# EAGLE board room_sensors (EAGLE 6.4)
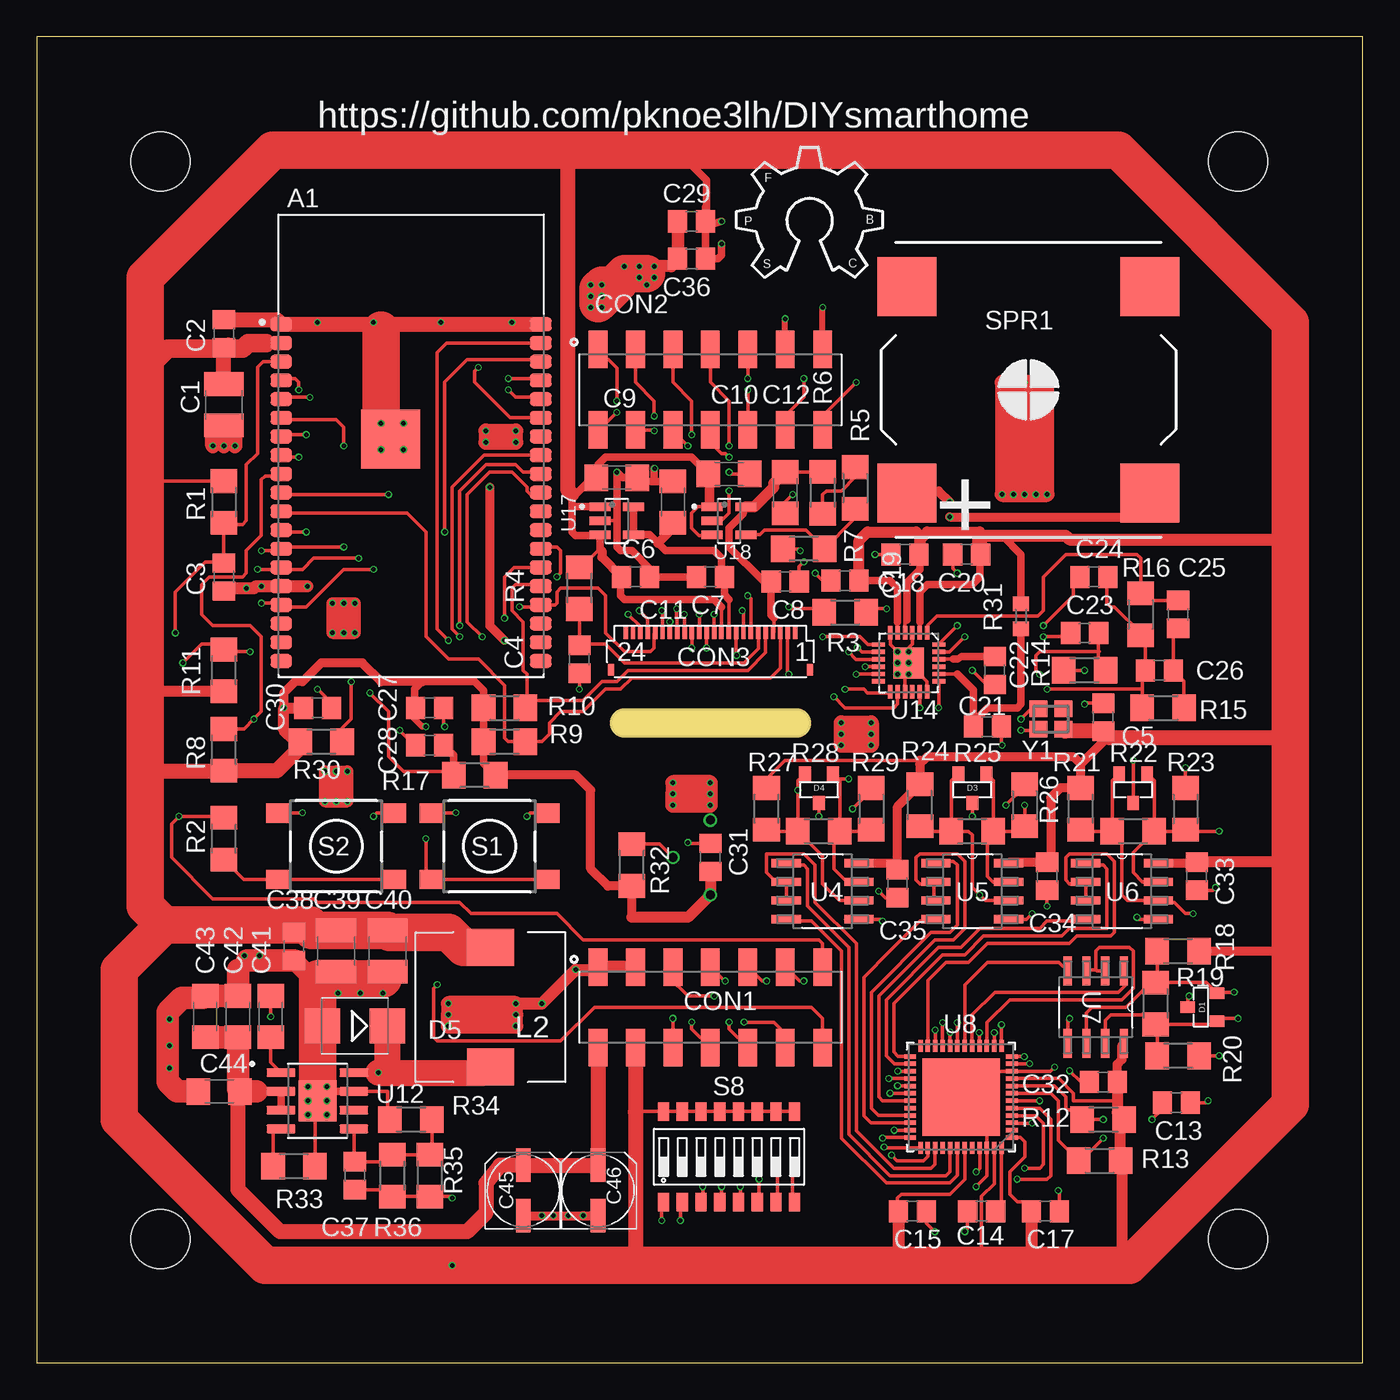
[diagram p6: board, top side]
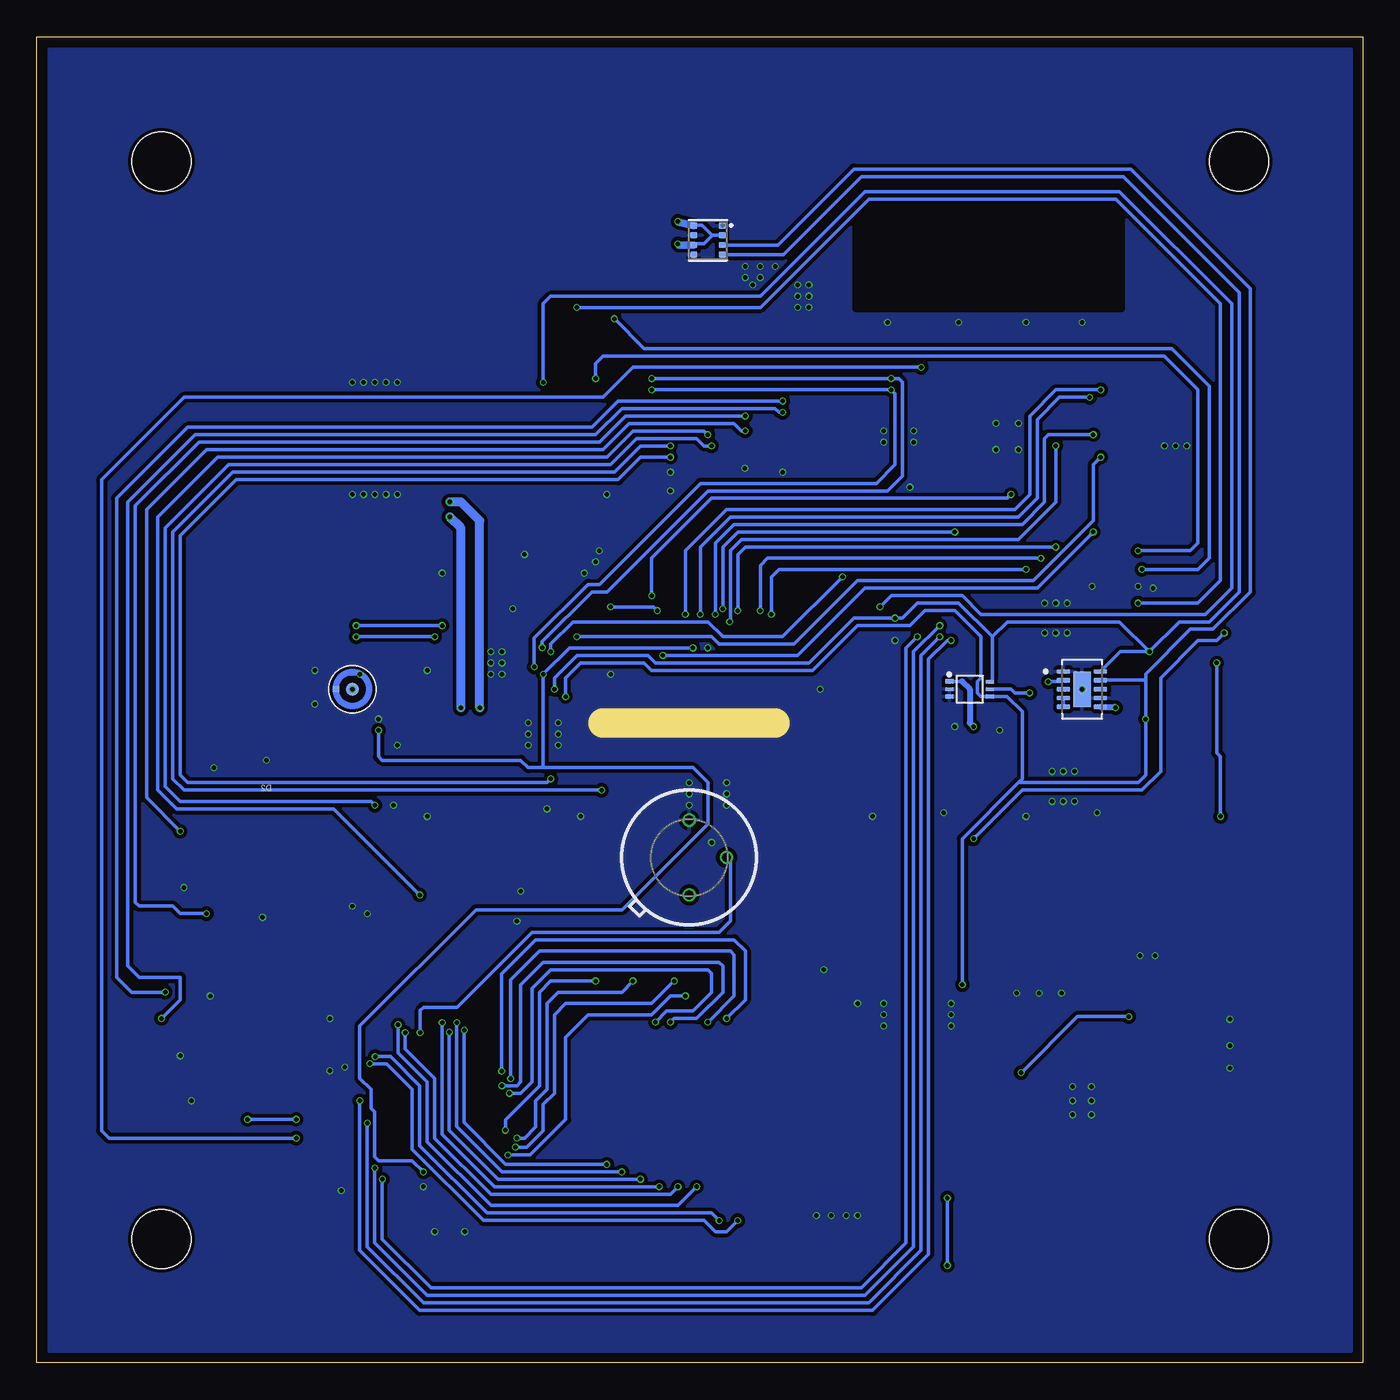
[diagram p7: board, bottom side, seen from below]

Size 90 x 90 mm. Coordinates in mm from the lower left corner, seen from the top.
Outline: 0,0 90,0 90,90 0,90 0,0
Copper layers (1*16): Top 0.035559375mm / dielectric 1.6mm / Bottom 0.035559375mm
Design rules "jlcpcb2layer": minimum track width 5mil, minimum drill 12mil, track to track 5mil, track to pad 5mil, pad to pad 5mil, via to via 5mil, smd to smd 5mil, copper to edge 8mil, drill to drill 6mil, minimum pad ring 5mil, minimum via ring 3mil, stop-mask expansion 2.5mil, vias tented up to drill 0mil, thermal gap 10mil
Holes 4 mm at 81.53,81.53 81.53,8.38 8.38,8.38 8.38,81.53
Milling: 1 lines

## Footprints (pad centres in the part's own frame; a part is rotated, then mirrored left to right if it is on the bottom)
XCVR_ESP32-WROVER-I = smd 1.45 x 0.93: 1 -8.81,8.26; 2 -8.81,6.99; 3 -8.81,5.72; 4 -8.81,4.45; 5 -8.81,3.18; 6 -8.81,1.91; 7 -8.81,0.64; 8 -8.81,-0.63; 9 -8.81,-1.9; 10 -8.81,-3.17; 11 -8.81,-4.44; 12 -8.81,-5.71; 13 -8.81,-6.98; 14 -8.81,-8.25; 15 -8.81,-9.52; 16 -8.81,-10.79; 17 -8.81,-12.06; 18 -8.81,-13.33; 19 -8.81,-14.6; 20 8.81,-14.6; 21 8.81,-13.33; 22 8.81,-12.06; 23 8.81,-10.79; 24 8.81,-9.52; 25 8.81,-8.25; 26 8.81,-6.98; 27 8.81,-5.71; 28 8.81,-4.44; 29 8.81,-3.17; 30 8.81,-1.9; 31 8.81,-0.63; 32 8.81,0.64; 33 8.81,1.91; 34 8.81,3.18; 35 8.81,4.45; 36 8.81,5.72; 37 8.81,6.99; 38 8.81,8.26 | smd 4 x 4: 39 -1.38,0.47
C1210 = smd 1.6 x 2.7: 1 -1.4,0; 2 1.4,0
C0805 = smd 1.3 x 1.5: 1 -0.95,0; 2 0.95,0
C1206 = smd 1.6 x 1.8: 1 -1.4,0; 2 1.4,0
UD-5X5,8_NICHICON = smd 2.3 x 1: + 1.725,0; - -1.7,0
95278-101A14LF = smd 1.27 x 2.54: 1 -7.62,2.73; 2 -7.62,-2.73; 3 -5.08,2.73; 4 -5.08,-2.73; 5 -2.54,2.73; 6 -2.54,-2.73; 7 0,2.73; 8 0,-2.73; 9 2.54,2.73; 10 2.54,-2.73; 11 5.08,2.73; 12 5.08,-2.73; 13 7.62,2.73; 14 7.62,-2.73
FH34SRJ-24S-0.5SH(50) = smd 0.4 x 0.8: NC1 -6.75,-2.5; NC2 6.75,-2.5 | smd 0.3 x 0.8: P$1 5.75,0; P$2 5.25,0; P$3 4.75,0; P$4 4.25,0; P$5 3.75,0; P$6 3.25,0; P$7 2.75,0; P$8 2.25,0; P$9 1.75,0; P$10 1.25,0; P$11 0.75,0; P$12 0.25,0; P$13 -0.25,0; P$14 -0.75,0; P$15 -1.25,0; P$16 -1.75,0; P$17 -2.25,0; P$18 -2.75,0; P$19 -3.25,0; P$20 -3.75,0; P$21 -4.25,0; P$22 -4.75,0; P$23 -5.25,0; P$24 -5.75,0
SOT-23-3 = smd 0.802 x 0.972: 1 -0.95,-1; 2 0.95,-1; 3 0,1
SMB = smd 2.4 x 2.4: A 2.2,0; C -2.2,0
SLF10145T-150M2R2-PF = smd 3.2 x 2.5: P$1 0,4.05; P$2 0,-4.05
R1206 = smd 1.6 x 1.803: 1 -1.422,0; 2 1.422,0
R0603 = smd 1 x 1.1: 1 -0.85,0; 2 0.85,0
DTSM-6 = smd 1.55 x 1.3: 1 -3.975,2.25; 2 3.975,2.25; 3 -3.975,-2.25; 4 3.975,-2.25
DHN-08F-T-V-T/R] = smd 0.76 x 1.25: 1A -4.445,3.075; 1B -4.445,-3.075; 2A -3.175,3.075; 2B -3.175,-3.075; 3A -1.905,3.075; 3B -1.905,-3.075; 4A -0.635,3.075; 4B -0.635,-3.075; 5A 0.635,3.075; 5B 0.635,-3.075; 6A 1.905,3.075; 6B 1.905,-3.075; 7A 3.175,3.075; 7B 3.175,-3.075; 8A 4.445,3.075; 8B 4.445,-3.075
SMS-2008MS-R = smd 4 x 4: + -8.25,-7; - 8.25,-7; M1 -8.25,7; M2 8.25,7
SOTFL50P300X75-6N = smd 0.55 x 0.3: 1 -1.375,0.525 | smd 0.55 x 0.25: 2 -1.375,0; 3 -1.375,-0.5; 4 1.375,-0.5; 5 1.375,0; 6 1.375,0.5
PSON65P250X250X100-8N = smd 0.49 x 0.45: 1 0.97,0.975; 2 0.97,0.325; 3 0.97,-0.325; 4 0.97,-0.975; 5 -0.97,-0.975; 6 -0.97,-0.325; 7 -0.97,0.325; 8 -0.97,0.975
SON60P400X270X110-11N = smd 0.91 x 0.32: 1 -1.255,1.2; 2 -1.255,0.6; 3 -1.255,0; 4 -1.255,-0.6; 5 -1.255,-1.2; 6 1.255,-1.2; 7 1.255,-0.6; 8 1.255,0; 9 1.255,0.6; 10 1.255,1.2 | smd 1.2 x 2.4: 11 0,0
SOIC127P600X175-8N = smd 1.981 x 0.559: 1 -2.464,1.905; 2 -2.464,0.635; 3 -2.464,-0.635; 4 -2.464,-1.905; 5 2.464,-1.905; 6 2.464,-0.635; 7 2.464,0.635; 8 2.464,1.905
21-0144H_T4877-3 = smd 0.813 x 0.305: 1 -3.454,2.75; 2 -3.454,2.25; 3 -3.454,1.75; 4 -3.454,1.25; 5 -3.454,0.75; 6 -3.454,0.25; 7 -3.454,-0.25; 8 -3.454,-0.75; 9 -3.454,-1.25; 10 -3.454,-1.75; 11 -3.454,-2.25; 12 -3.454,-2.75; 25 3.454,-2.75; 26 3.454,-2.25; 27 3.454,-1.75; 28 3.454,-1.25; 29 3.454,-0.75; 30 3.454,-0.25; 31 3.454,0.25; 32 3.454,0.75; 33 3.454,1.25; 34 3.454,1.75; 35 3.454,2.25; 36 3.454,2.75 | smd 0.305 x 0.813: 13 -2.75,-3.454; 14 -2.25,-3.454; 15 -1.75,-3.454; 16 -1.25,-3.454; 17 -0.75,-3.454; 18 -0.25,-3.454; 19 0.25,-3.454; 20 0.75,-3.454; 21 1.25,-3.454; 22 1.75,-3.454; 23 2.25,-3.454; 24 2.75,-3.454; 37 2.75,3.454; 38 2.25,3.454; 39 1.75,3.454; 40 1.25,3.454; 41 0.75,3.454; 42 0.25,3.454; 43 -0.25,3.454; 44 -0.75,3.454; 45 -1.25,3.454; 46 -1.75,3.454; 47 -2.25,3.454; 48 -2.75,3.454 | smd 5.258 x 5.258: 49 0,0
SOIC127P600X170-8N = smd 1.97 x 0.6: 1 -2.475,1.905; 2 -2.475,0.635; 3 -2.475,-0.635; 4 -2.475,-1.905; 5 2.475,-1.905; 6 2.475,-0.635; 7 2.475,0.635; 8 2.475,1.905 | smd 2.58 x 2.8: 9 0,0
QFN-24_ALT2 = smd 0.9 x 0.3: 1 -2.05,1.25; 2 -2.05,0.75; 3 -2.05,0.25; 4 -2.05,-0.25; 5 -2.05,-0.75; 6 -2.05,-1.25; 13 1.95,-1.25; 14 1.95,-0.75; 15 1.95,-0.25; 16 1.95,0.25; 17 1.95,0.75; 18 1.95,1.25 | smd 0.3 x 0.9: 7 -1.25,-2.05; 8 -0.75,-2.05; 9 -0.25,-2.05; 10 0.25,-2.05; 11 0.75,-2.05; 12 1.25,-2.05; 19 1.25,2.05; 20 0.75,2.05; 21 0.25,2.05; 22 -0.25,2.05; 23 -0.75,2.05; 24 -1.25,2.05 | smd 2.1 x 2.1: EP 0,0
SOP95P275X110-5N = smd 1.42 x 0.58: 1 -1.145,0.95; 2 -1.145,0; 3 -1.145,-0.95; 4 1.145,-0.95; 5 1.145,0.95
MIC = smd 0.9 x 0.9: + 0,0 | smd 0.4 x 0.4: - -1.113,0.01
TO-39 = drill 0.6: 1 0,2.54; 2 -2.54,0; 3 0,-2.54
OSCCC250X200X80-4N = smd 1.2 x 1.1: 1 -0.853,-0.704; 2 0.847,-0.704; 3 0.847,0.696; 4 -0.853,0.696

## Placement (x,y rotation side)
A1  ESP32-WROVER-I  [XCVR_ESP32-WROVER-I]  25.4,62.23 0 top
C1  22u 16V  [C1210]  12.7,65.02 270 top
C2  100nF 50V  [C0805]  12.7,69.85 90 top
C3  100nF 50V  [C0805]  12.7,53.34 270 top
C4  100nF 50V  [C0805]  36.83,47.75 270 top
C5  100nF 50V  [C0805]  72.39,43.81 90 top
C6  100nF 50V  [C0805]  40.64,53.34 0 top
C7  100nF 50V  [C0805]  45.72,53.34 180 top
C8  100nF 50V  [C0805]  50.8,53.02 0 top
C9  2u2 16V  [C1206]  39.37,60.07 0 top
C10  2u2 16V  [C1206]  46.99,60.33 0 top
C11  2u2 16V  [C1206]  43.18,58.42 90 top
C12  2u2 16V  [C1206]  50.8,59.05 270 top
C13  100nF 50V  [C0805]  77.34,17.65 0 top
C14  1uF 16V  [C0805]  64.14,10.29 180 top
C15  100nF 50V  [C0805]  59.44,10.29 0 top
C17  100nF 50V  [C0805]  68.45,10.29 0 top
C18  4u7 16V  [C0805]  58.93,54.86 180 top
C19  4u7 16V  [C0805]  54.86,53.09 180 top
C20  4u7 16V  [C0805]  63.12,54.86 180 top
C21  4u7 16V  [C0805]  64.52,43.18 180 top
C22  4u7 16V  [C0805]  65.02,46.99 90 top
C23  1u 16V  [C0805]  71.12,49.53 0 top
C24  1u 16V  [C0805]  71.75,53.34 0 top
C25  4u7 16V  [C0805]  77.47,50.8 270 top
C26  220p  [C0805]  76.2,46.99 180 top
C27  100nF 50V  [C0805]  26.67,44.45 0 top
C28  100nF 50V  [C0805]  26.67,41.91 180 top
C29  100nF 50V  [C0805]  44.45,77.47 180 top
C30  4u7 16V  [C0805]  19.05,44.45 0 top
C31  4u7 16V  [C0805]  45.72,34.29 90 top
C32  100nF 50V  [C0805]  72.39,19.05 180 top
C33  100nF 50V  [C0805]  78.74,33.02 270 top
C34  100nF 50V  [C0805]  68.58,33.02 270 top
C35  100nF 50V  [C0805]  58.42,32.51 270 top
C36  100nF 50V  [C0805]  44.45,74.93 180 top
C37  NM  [C0805]  21.59,12.7 90 top
C38  1uF 16V  [C0805]  17.46,28.26 270 top
C39  47u 10V  [C1210]  20.32,27.94 270 top
C40  47u 10V  [C1210]  23.81,27.94 270 top
C41  100n 50V  [C1206]  15.88,23.5 90 top
C42  100n 50V  [C1206]  13.65,23.5 90 top
C43  2u2 50V  [C1206]  11.43,23.5 90 top
C44  2u2 50V  [C1206]  12.38,18.41 180 top
C45  47u 35V  [UD-5X5,8_NICHICON]  33.02,11.68 90 top
C46  47u 35V  [UD-5X5,8_NICHICON]  38.1,11.68 90 top
CON1  95278-101A14LF  [95278-101A14LF]  45.72,24.13 0 top
CON2  95278-101A14LF  [95278-101A14LF]  45.72,66.04 0 top
CON3  OV2640-HDF3M-811FRONTLOOKING  [FH34SRJ-24S-0.5SH(50)]  45.72,49.53 0 top
D1  CDSOT23-0502B  [SOT-23-3]  79.12,24.13 90 top
D2  CDSOT23-0502B  [SOT-23-3]  74.42,38.99 180 top
D3  CDSOT23-0502B  [SOT-23-3]  63.5,38.99 180 top
D4  CDSOT23-0502B  [SOT-23-3]  53.09,38.99 180 top
D5  B360B-13-F  [SMB]  21.59,22.86 180 top
L2  5u6 3A8  [SLF10145T-150M2R2-PF]  30.8,24.13 180 top
LOGO1  OSHW_LOGO_FILLX0350-NT  [OSHW_FILLX350_NOTEXT]  47.5,73.66 0 top
R1  10k  [R1206]  12.7,58.42 90 top
R2  100R  [R1206]  12.7,35.56 270 top
R3  12k  [R1206]  54.86,50.93 180 top
R4  4k7  [R1206]  36.83,52.58 270 top
R5  33k  [R1206]  55.56,59.37 90 top
R6  100k  [R1206]  53.34,59.05 90 top
R7  100k  [R1206]  52.07,55.24 0 top
R8  4k7  [R1206]  12.7,41.59 270 top
R9  4k7  [R1206]  31.75,42.16 180 top
R10  4k7  [R1206]  31.75,44.45 180 top
R11  4k7  [R1206]  12.7,46.99 270 top
R12  4k7  [R1206]  72.39,16.51 180 top
R13  4k7  [R1206]  72.14,13.72 180 top
R14  0R  [R1206]  71.12,46.99 0 top
R15  47k  [R1206]  76.45,44.45 180 top
R16  680R  [R1206]  74.93,50.8 90 top
R17  1k  [R1206]  29.72,39.88 0 top
R18  1k  [R1206]  77.47,27.94 180 top
R19  120R  [R1206]  75.95,24.38 270 top
R20  1k  [R1206]  77.47,20.83 0 top
R21  1k  [R1206]  70.87,37.59 270 top
R22  120R  [R1206]  74.42,36.07 0 top
R23  1k  [R1206]  77.98,37.59 90 top
R24  1k  [R1206]  59.94,37.85 270 top
R25  120R  [R1206]  63.5,36.07 0 top
R26  1k  [R1206]  67.06,37.85 90 top
R27  1k  [R1206]  49.53,37.59 270 top
R28  120R  [R1206]  53.09,36.07 0 top
R29  1k  [R1206]  56.64,37.59 90 top
R30  4k7  [R1206]  19.3,42.16 180 top
R31  0R  [R0603]  66.8,50.67 270 top
R32  1k  [R1206]  40.39,33.78 270 top
R33  33k  [R1206]  17.46,13.34 0 top
R34  12k  [R1206]  25.4,16.51 180 top
R35  68k  [R1206]  26.67,12.7 90 top
R36  100k  [R1206]  24.13,12.7 90 top
S1  DTSM-6  [DTSM-6]  30.73,35.05 0 top
S2  DTSM-6  [DTSM-6]  20.32,35.05 0 top
S8  DHN-08F-T-V-T/R]  [DHN-08F-T-V-T/R]]  46.99,13.97 0 top
SPR1  SMS-208MS-R  [SMS-2008MS-R]  67.31,66.04 0 top
U1  BH1750FVI-TR  [SOTFL50P300X75-6N]  26.67,45.72 0 bottom
U2  BME280  [PSON65P250X250X100-8N]  44.45,76.2 0 bottom
U3  CCS811B-JOPD500  [SON60P400X270X110-11N]  19.05,45.72 0 bottom
U4  SN65HVD11DR  [SOIC127P600X175-8N]  53.34,32 0 top
U5  SN65HVD11DR  [SOIC127P600X175-8N]  63.5,32 0 top
U6  SN65HVD11DR  [SOIC127P600X175-8N]  73.66,32 0 top
U7  SN65HVD11DR  [SOIC127P600X175-8N]  71.88,24.13 270 top
U8  MAX14830ETMT  [21-0144H_T4877-3]  62.74,18.03 180 top
U12  LMR16020  [SOIC127P600X170-8N]  19.05,17.78 0 top
U14  WM8974  [QFN-24_ALT2]  59.18,47.5 270 top
U17  RT9043GB  [SOP95P275X110-5N]  39.37,57.15 0 top
U18  RT9043GB  [SOP95P275X110-5N]  46.99,57.15 0 top
U$6  B4013AM423-008  [MIC]  68.58,45.72 0 bottom
U$7  AS312  [TO-39]  45.72,34.29 180 bottom
Y1  X1G004171001800 12MHz  [OSCCC250X200X80-4N]  68.83,43.69 180 top

## Tracks (layer width: path | path; a pad name or v marks a point on that pad's centre or on a via)
+1V2
  Top 0.254: 46.99,51.82 46.99,49.55 CON3.P$10
  Top 0.508: U17.5 U17.4 41.59,56.2 42.16,55.63 42.67,55.12 45.97,55.12 46.48,54.61 46.48,53.53 C7.1 46.67,52.14 46.99,51.82
  Top 0.61: C11.1 43.18,56.64 42.16,55.63
+2V8
  Top 0.254: C12.1 53.32,60.45 R6.2 | 50.04,50.55 50.04,49.6 CON3.P$4
  Top 0.508: U18.5 47.94,57.59 46.99,56.64 46.99,55.37 49.28,53.09 49.79,53.09 C8.1 49.85,50.73 50.04,50.55
  Top 0.762: U18.5 48.7,58.1 50.04,59.44 50.04,59.69 C12.1
+3V3  (via drill 0.3)
  Top 0.254: C37.1 23.66,11.75 R36.1 R35.1 28.09,11.28 v28.19,11.18 | R1.2 7.47,59.84 7.37,59.94 | 7.47,45.57 7.37,45.47 | 7.4,40.17 7.37,40.13 | S8.8A S8.7A S8.6A S8.5A S8.4A S8.3A S8.2A S8.1A 40.67,17.05 40.64,17.02 | 46.48,51.31 46.48,49.54 CON3.P$11 | 45.78,56.13 44.96,56.13 44.45,56.64 44.45,57.66 44.89,58.1 U18.1 45.79,58.1 45.72,58.17 | R4.1 36.98,54 38.23,55.25 | 45.65,77.22 C29.1 | 73.66,13.72 73.66,16.26 73.41,16.51 73.41,19.05 C32.1 | U14.2 59.93,50.28 59.94,50.29 | U14.5 58.43,50.28 58.42,50.29 | 59.05,50.42 58.93,50.29 U14.4 | C17.1 66.87,10.92 66.55,10.92 66.04,11.43 66.04,12.95 67.06,13.97 67.06,14.99 66.76,15.28 U8.1 U8.2 | 58.67,10.47 C15.1 58.42,10.35 58.42,11.18 58.67,11.43 61.98,11.43 62.99,12.44 U8.43 | U8.47 64.99,12.16 64.14,11.3 64.14,6.73 64.01,6.6 | U8.9 69.36,19.28 70.36,18.29 70.36,17.78 73.34,17.78 | R27.1 49.53,39.62 50.8,40.89 59.69,40.89 59.94,40.64 | 59.94,40.89 60.2,40.89 | 7.37,67.31 7.37,63.62 7.62,63.37 | 78.74,34.04 C33.1 | 64.01,56.13 64.01,56.39
  Top 0.406: v26.42,43.18 26.16,43.18 25.4,43.94 25.4,44.13 C27.1
  Top 0.508: 36.32,58.17 36.32,58.93 36.57,58.93 37.72,60.07 C9.1 38.1,60.2 38.1,60.96 38.61,61.47 44.45,61.47 45.72,60.2 45.72,58.17 | 36.32,58.17 36.32,56.39 36.58,56.13 38.16,56.13 U17.3 38.23,55.25 38.35,55.12 | U17.1 36.39,58.1 36.32,58.17 | C10.1 45.59,58.35 U18.1 | 45.78,56.13 U18.3 | 46.48,51.31 45.97,51.82 39.88,51.82 39.62,52.07 39.62,53.27 C6.1 | v46.48,77.47 45.65,77.22 | v46.48,75.95 46.48,75.18 46.23,74.93 45.47,74.93 | 36.07,81.53 44.2,81.53 45.47,80.26 45.47,78.49 | 45.47,78.49 45.47,77.54 C29.1 | C36.1 45.4,78.42 45.47,78.49 | C20.1 64.01,54.8 64.01,53.34 63.5,52.83 60.45,52.83 59.94,52.32 59.94,50.29 | 59.05,50.42 59.05,52.96 59.94,53.85 59.94,54.8 C18.1 | 58.42,50.29 58.42,52.58 57.91,53.09 C19.1 | R31.1 66.8,54.86 65.53,56.13 64.01,56.13 | R10.2 R9.2 | R9.2 30.33,40.69 R17.2 | R9.2 30.33,45.62 29.72,46.23 26.16,46.23 25.65,45.72 25.65,44.52 C27.1
  Top 0.61: U6.8 78.68,33.91 C33.1 | C32.1 73.34,20.25 73.66,20.57 73.66,21.54 U7.8 | R18.1 84.84,27.94 85.09,28.19 | 69.85,42.83 Y1.4 | R17.2 36.58,39.88 37.59,38.86 37.59,33.53 38.76,32.36 R32.2 40.39,30.23 | U4.8 57.97,33.91 C35.1 58.42,37.74 R24.1 59.94,40.64 59.94,40.89 | 70.87,40.64 R21.1 69.49,39.01 68.83,38.35 68.83,34.22 C34.1 66.03,33.97 U5.8 | 70.87,40.64 72.74,42.51 | 60.2,40.89 60.45,41.15 70.36,41.15 70.87,40.64 | 26.16,46.23 23.37,46.23 22.1,47.5 19.3,47.5 18.03,46.23 17.53,46.23 16.76,45.47 v16.76,44.45 | 38.35,55.12 38.35,54.68 C6.1
  Top 0.762: 13.02,69.22 C2.1 | A1.2 15.56,69.22 | R11.2 7.47,45.57 | C30.1 v16.76,44.45 16.76,42.93 17.53,42.16 R30.2 17.78,42.06 17.78,41.66 | C31.1 U$7.1 44.2,30.23 40.39,30.23 | C32.1 73.34,17.78 73.34,16.98 R12.1 73.56,16.26 R13.1 | 78.74,34.04 85.09,34.04 | 73.66,13.72 73.66,6.86 73.91,6.6 | C19.1 55.81,55.81 56.39,56.39 59.69,56.39 59.94,56.13 59.94,54.93 C18.1 | 59.94,54.8 59.94,55.88 60.45,56.39 64.01,56.39
  Top 0.813: C15.1 58.49,6.67 58.42,6.6 | C17.1 67.5,6.29 | 67.5,6.29 67.31,6.1 | 67.5,6.29 67.82,6.6 | 64.01,56.13 69.85,56.13 70.1,55.88 84.84,55.88 85.09,55.63
  Top 1.016: CON1.4 40.64,17.02 40.64,7.11 40.13,6.6 | 35.81,82.3 35.81,81.79 36.07,81.53 36.07,59.18 36.32,58.93 | 85.09,42.42 72.84,42.42 72.74,42.51 C5.1 69.81,42.87 Y1.4 | 64.01,54.8 64.01,56.13 | 7.4,40.17 R8.2 16.29,40.17 17.78,41.66 | C1.1 C2.1
  Top 1.27: 15.56,69.22 14.35,69.22 13.97,68.83 12.77,68.83 | 12.77,68.83 C2.1 | 12.77,68.83 8.89,68.83 7.37,67.31 | 16.95,29.72 C38.1 | 7.62,63.37 7.49,63.37 7.37,63.25
  Top 2.54: L2.P$2 28.97,28.18 27.94,29.21 23.94,29.21 C40.1 C39.1 18.67,29.34 18.54,29.72 16.95,29.72 8.64,29.72 | 8.64,29.72 5.59,26.67 5.59,16.51 15.49,6.6 v28.19,6.6 40.13,6.6 58.42,6.6 64.01,6.6 67.82,6.6 73.91,6.6 74.17,6.6 85.09,17.53 85.09,28.19 85.09,34.04 85.09,42.42 85.09,55.63 85.09,70.61 73.41,82.3 35.81,82.3 16,82.3 7.37,73.66 7.37,67.31 7.37,63.25 7.37,59.94 7.37,45.47 7.37,40.13 7.37,30.99 8.64,29.72
  Bottom 0.254: U2.2 44.12,76.53 44.2,76.45 | U2.6 45.35,75.95 44.7,75.95 44.2,76.45 | 44.2,76.45 44.2,76.58 44.83,77.22 45.38,77.22 U2.8 | 46.44,77.43 v46.48,77.47 | 46.41,75.88 v46.48,75.95 | v28.19,11.18 v28.19,6.6 | U1.1 27.2,46.24
  Bottom 0.406: U3.6 16.83,44.52 v16.76,44.45 | 27.2,46.24 26.67,45.72 26.67,43.43 v26.42,43.18
  Bottom 0.508: U2.8 46.44,77.43 | U2.6 46.41,75.88
+24V
  Top 0.508: 14.92,18.41 U12.2 U12.3
  Top 0.813: 33.11,13.49 C45.+
  Top 1.016: C44.1 13.65,18.29 13.65,11.75 16.51,8.89 29.21,8.89 30.48,10.16 30.48,12.19 31.44,13.41 C45.+ C46.+ CON1.2
  Top 1.524: C43.1 C42.1 13.65,18.55 C44.1 14.92,18.41
AS312_OUT  (via drill 0.3)
  Top 0.254: U8.16 v63.99,22.4 v63.98,22.4 | R32.1 42.27,35.2 U$7.2
  Bottom 0.254: v63.98,22.4 63.98,23.9 63.75,24.13 61.47,24.13 56.39,29.21 43.69,29.21 42.93,29.97 42.93,34.04 U$7.2
CLK_12M  (via drill 0.3)
  Top 0.254: CON3.P$13 v45.47,48.52 v45.47,48.51 | v55.63,46.74 57.12,46.74 U14.11 | v66.8,42.93 67.92,42.93 Y1.3 | 64.01,14.53 64.01,14.56 U8.45 | 64.01,14.53 63.98,14.5 63.98,14.38 | 63.98,14.38 63.98,14.35 64.01,14.33 64.01,14.35 63.98,14.38 | 64.01,14.53 64.01,13.21 v63.75,12.95
  Bottom 0.254: v45.47,48.51 53.85,48.51 v55.63,46.74 55.63,40.39 | 55.63,40.39 45.47,40.39 44.45,39.37 44.45,36.58 50.29,30.73 60.2,30.73 68.07,22.86 68.07,19.3 67.31,18.54 67.31,17.27 67.06,17.02 67.06,13.97 66.8,13.72 64.52,13.72 v63.75,12.95 | 55.63,40.39 56.64,40.39 57.15,40.89 66.55,40.89 66.8,41.15 v66.8,42.93
ESP32_BOOT
  Top 0.254: S2.4 S2.3 14.04,32.8 R2.2
ESP32_EN  (via drill 0.3)
  Top 0.254: A1.3 15.37,67.95 14.99,67.56 14.99,61.72 14.22,60.96 14.22,57.15 13.97,56.9 12.8,56.9 R1.1 C3.1 12.63,54.36 11.43,54.36 9.4,52.32 v9.4,49.53 | v26.42,35.56 26.42,33.15 S1.3 S1.4
  Bottom 0.254: v26.42,35.56 23.11,38.86 14.99,38.86 13.72,40.13 13.72,46.48 11.18,49.02 9.91,49.02 v9.4,49.53
ESP32_EN1
  Top 0.254: R5.1 55.37,57.76 55.37,57.15 53.49,55.27 R7.2 52.22,56.52 49.4,56.52 49.09,56.2 U18.4
ESP32_IO0  (via drill 0.3)
  Top 0.254: A1.25 32.39,53.98 31.75,53.34 v31.75,50.55 | v14.48,48.26 12.85,48.26 R11.1 12.34,48.77 11.18,48.77 v9.91,47.5 | v54.86,45.72 56.13,45.72 56.39,45.47 57.85,45.47 U14.13 | CON1.13 53.34,28.45 53.09,28.7 37.08,28.7 35.31,30.48 29.46,30.48 28.7,31.24 19.05,31.24 18.8,31.5 11.94,31.5 9.14,34.29 9.14,36.58 v9.65,37.08 12.6,37.08 R2.1
  Bottom 0.254: 25.15,49.28 25.15,46.37 U1.6 | 17.78,46.94 U3.10 16.45,48.26 v14.48,48.26 | 25.15,49.28 27.43,51.56 30.23,51.56 31.24,50.55 v31.75,50.55 34.54,50.55 37.59,47.5 48.01,47.5 48.51,48.01 53.34,48.01 54.86,46.48 v54.86,45.72 | U2.4 39.33,75.22 34.04,80.52 16.26,80.52 8.38,72.64 8.38,52.32 10.41,50.29 12.45,50.29 v14.48,48.26 | v9.65,37.08 9.65,41.15 9.91,41.4 v9.91,47.5 | 25.15,49.28 24.13,50.29 16.51,50.29 v14.48,48.26
ESP32_IO1  (via drill 0.3)
  Top 0.254: CON2.9 v48.26,66.8 | v32,66.8 34.09,66.8 | U14.8 55.99,48.25 v55.7,48.54
  Top 0.406: 34.09,66.8 A1.35
  Bottom 0.254: v48.26,66.8 v32,66.8 31.5,66.8 31.24,66.55 31.24,60.2 32.26,59.18 44.45,59.18 51.31,52.32 52.32,52.32 55.7,48.95 v55.7,48.54
ESP32_IO2
  Top 0.254: A1.24 34.09,52.83 32.51,52.83 32.26,52.58 32.26,51.05 33.02,50.29 33.02,46.99 33.27,46.74 33.27,44.45 R10.1 33.68,44.96 37.08,44.96 38.35,46.23 39.37,46.23 40.13,46.99 48.26,46.99 49.47,48.2 CON3.P$5
ESP32_IO3  (via drill 0.3)
  Top 0.254: CON2.10 v48.26,66.04 | v32,66.04 32.51,65.53 34.09,65.53 | U14.10 56.39,47.25 v56.24,47.24
  Top 0.406: 34.09,65.53 A1.34
  Bottom 0.254: v48.26,66.04 v32,66.04 31.75,65.79 31.75,60.96 33.02,59.69 44.96,59.69 51.82,52.83 52.58,52.83 56.24,49.17 v56.24,47.24
ESP32_IO4  (via drill 0.3)
  Top 0.254: U14.9 55.6,47.75 55.09,48.26 v55.12,48.26 | A1.26 34.33,55.37 35.31,55.37 35.56,55.12 35.56,53.59 v35.31,53.34
  Bottom 0.254: v55.12,48.26 55.12,48.77 53.59,50.29 44.45,50.29 43.43,49.28 39.37,49.28 v35.31,53.34
ESP32_IO5  (via drill 0.3)
  Top 0.254: U8.5 66.2,17.27 68.07,17.27 68.83,16.51 68.83,12.7 68.58,12.45 v66.55,12.45 | v30.23,49.28 29.21,50.29 29.21,58.93 30.73,60.45 32.26,60.45 33.27,59.44 33.27,59.18 33.53,58.93 34.08,58.93 A1.29
  Bottom 0.254: v66.55,12.45 66.55,8.38 63.25,5.08 34.04,5.08 30.99,8.13 30.99,48.51 v30.23,49.28
ESP32_IO12  (via drill 0.3)
  Top 0.254: v14.99,53.85 16.46,53.85 | CON3.P$21 41.47,50.48 v40.89,51.05 | v21.84,54.61 18.8,54.61 18.03,53.85 16.72,53.85 A1.14
  Top 0.406: CON2.11 v50.8,70.87 | 16.46,53.85 A1.14
  Bottom 0.254: v14.99,53.85 11.18,53.85 10.41,54.61 10.41,66.29 12.95,68.83 48.77,68.83 v50.8,70.87 | v40.89,51.05 40.89,54.1 40.39,54.61 v21.84,54.61
ESP32_IO13  (via drill 0.3)
  Top 0.254: v15.24,51.56 16.47,51.56 | CON3.P$22 40.97,49.96 v40.13,50.8 | v22.86,53.85 20.83,53.85 18.29,51.31 16.72,51.31 A1.16
  Top 0.406: CON2.13 v53.34,71.63 | 16.47,51.56 A1.16
  Bottom 0.254: v15.24,51.56 11.18,51.56 9.65,53.09 9.65,71.88 16.76,78.99 33.53,78.99 40.89,71.63 v53.34,71.63 | v40.13,50.8 40.13,53.34 39.62,53.85 v22.86,53.85
ESP32_IO14  (via drill 0.3)
  Top 0.254: 50.8,64.26 52.07,65.53 v52.07,66.8 | v15.24,55.12 16.46,55.12 | CON3.P$19 42.47,51 v42.42,51.05 | v20.83,55.37 16.71,55.37 A1.13
  Top 0.406: CON2.12 50.8,64.26 | 16.46,55.12 A1.13
  Bottom 0.254: v52.07,66.8 52.07,67.82 51.56,68.33 13.46,68.33 11.18,66.04 11.18,55.63 11.68,55.12 v15.24,55.12 | v42.42,51.05 42.42,54.86 41.91,55.37 v20.83,55.37
ESP32_IO15  (via drill 0.3)
  Top 0.254: 53.34,64.26 v55.63,66.55 | v32.77,51.31 34.08,51.31 | A1.23 35.17,51.44 35.31,51.57 35.31,52.32 35.56,52.58 38.1,52.58 38.61,52.07 38.61,49.53 39.88,48.26 41.66,48.26 41.91,48.51 41.91,49.47 CON3.P$20
  Top 0.406: CON2.14 53.34,64.26 | 34.08,51.31 A1.23
  Bottom 0.254: v55.63,66.55 55.63,71.88 55.12,72.39 40.89,72.39 33.78,79.5 16.51,79.5 8.89,71.88 8.89,52.58 10.67,50.8 25.91,50.8 27.18,52.07 32,52.07 v32.77,51.31
ESP32_IO18  (via drill 0.3)
  Top 0.254: v28.7,50.04 28.7,59.18 30.48,60.96 32.51,60.96 33.02,60.45 34.09,60.45 A1.30 | U8.4 66.21,16.76 67.82,16.76 68.33,16.26 68.33,13.46 68.07,13.21 v67.06,13.21
  Bottom 0.254: v67.06,13.21 67.06,8.13 63.5,4.57 33.78,4.57 30.48,7.87 30.48,48.26 v28.7,50.04
ESP32_IO19  (via drill 0.3)
  Top 0.254: v67.56,16.26 66.22,16.26 U8.3 | v28.7,49.28 28.19,49.78 28.19,59.44 30.36,61.6 A1.31
  Bottom 0.254: v67.56,16.26 67.56,7.87 63.75,4.06 33.53,4.06 29.97,7.62 29.97,48.01 v28.7,49.28
ESP32_IO21  (via drill 0.3)
  Top 0.254: U8.7 68.84,18.28 69.34,17.78 69.34,15.09 R13.2 70.87,13.56 70.87,13.72 v72.39,15.24 | A1.33 32.13,64.14 29.72,66.55 29.72,67.31 v29.97,67.56
  Bottom 0.254: v29.97,67.56 49.53,67.56 51.56,65.53 80.01,65.53 85.6,59.94 85.6,15.75 85.09,15.24 v72.39,15.24
ESP32_IO22  (via drill 0.3)
  Top 0.254: 43.47,51.15 v43.43,51.18 43.43,50.55 43.47,50.51 CON3.P$17 | v27.69,56.39 27.69,66.55 29.21,68.07 34.09,68.07 A1.36
  Bottom 0.254: v43.43,51.18 43.43,55.37 42.42,56.39 v27.69,56.39
ESP32_IO23  (via drill 0.3)
  Top 0.254: A1.37 27.82,69.22 27.18,68.58 27.18,49.78 v27.94,49.02 | v68.07,17.78 U8.6
  Bottom 0.254: v68.07,17.78 68.07,7.62 64.01,3.56 33.27,3.56 29.46,7.37 29.46,47.75 28.19,49.02 v27.94,49.02
ESP32_IO25  (via drill 0.3)
  Top 0.254: CON3.P$7 48.47,51.86 v48.26,52.07 | v23.88,58.93 16.72,58.93 A1.10
  Bottom 0.254: v48.26,52.07 48.26,54.61 44.2,58.67 24.13,58.67 v23.88,58.93
ESP32_IO26
  Top 0.254: A1.11 16.72,57.66 25.15,57.66 26.42,56.39 26.42,49.28 27.94,47.75 29.97,47.75 31.75,45.97 31.75,42.42 32,42.16 R9.1 34.29,42.16 34.8,42.67 34.8,43.43 35.56,44.2 37.08,44.2 38.61,45.72 39.62,45.72 40.39,46.48 49.78,46.48 50.47,47.17 CON3.P$3
ESP32_IO27  (via drill 0.3)
  Top 0.254: CON3.P$9 47.47,48.03 v47.5,48.01 | v18.29,56.39 16.72,56.39 A1.12
  Bottom 0.254: v18.29,56.39 22.1,52.58 33.78,52.58 38.35,48.01 v47.5,48.01
ESP32_IO32  (via drill 0.3)
  Top 0.254: U14.7 56.41,48.75 55.88,49.28 v53.34,49.28 | v17.78,61.47 16.72,61.47 A1.8
  Bottom 0.254: v53.34,49.28 44.2,49.28 43.69,48.77 38.61,48.77 34.29,53.09 22.35,53.09 18.29,57.15 18.29,60.96 v17.78,61.47
ESP32_IO33  (via drill 0.3)
  Top 0.254: R8.1 14.06,43.01 v14.73,43.69 15.24,44.2 15.24,49.28 14.48,50.04 11.94,50.04 11.18,50.8 11.18,52.83 11.68,53.34 13.97,53.34 14.22,53.59 14.22,55.12 15.24,56.13 15.24,59.94 15.49,60.2 16.46,60.2 A1.9 | U14.14 58.43,44.72 58.17,44.45 54.86,44.45 v54.1,45.21 | v27.18,25.65 26.92,25.4 26.92,22.1 27.18,21.84 35.56,21.84 37.85,24.13 52.58,24.13 53.34,23.37 CON1.14
  Bottom 0.254: 14.73,46.33 17.79,46.33 U3.9 | U2.3 39.7,75.88 34.54,81.03 15.75,81.03 7.62,72.9 7.62,52.32 10.16,49.78 11.68,49.78 14.73,46.74 14.73,46.33 | 14.73,46.33 v14.73,43.69 14.73,39.88 15.24,39.37 23.37,39.37 | v54.1,45.21 54.1,46.48 53.09,47.5 48.77,47.5 48.26,46.99 37.34,46.99 34.29,50.04 30.73,50.04 29.72,51.05 27.69,51.05 25.91,49.28 25.91,46.48 26.16,46.23 26.16,45.47 25.91,45.21 U1.4 24.14,45.22 23.11,44.2 23.11,39.62 23.37,39.37 | 23.37,39.37 27.18,35.56 v27.18,25.65
ESP32_IO34  (via drill 0.3)
  Top 0.254: CON3.P$18 42.97,50.25 v42.98,50.29 | v20.83,62.23 20.83,63.5 20.32,64.01 16.72,64.01 A1.6
  Bottom 0.254: v20.83,62.23 20.83,58.42 23.37,55.88 42.16,55.88 42.93,55.12 42.93,50.34 v42.98,50.29
ESP32_IO35  (via drill 0.3)
  Top 0.254: CON3.P$16 43.97,50.77 v43.94,50.8 | v18.29,62.99 16.71,62.99 A1.7
  Bottom 0.254: v43.94,50.8 43.94,55.63 42.67,56.9 23.11,56.9 21.59,58.42 21.59,62.74 21.34,62.99 v18.29,62.99
ESP32_IO36  (via drill 0.3)
  Top 0.254: CON3.P$12 45.97,50.54 45.97,50.55 v45.97,50.8 | 16.72,66.55 A1.4 16.71,66.8 17.53,66.8 17.78,66.55 v17.78,66.04
  Bottom 0.254: v45.97,50.8 45.97,55.12 43.18,57.91 23.62,57.91 22.61,58.93 22.61,64.26 20.83,66.04 v17.78,66.04
ESP32_IO39  (via drill 0.3)
  Top 0.254: CON3.P$14 44.97,50.79 v44.96,50.8 | v18.54,65.53 16.71,65.53 A1.5
  Bottom 0.254: v44.96,50.8 44.96,55.37 42.93,57.4 23.37,57.4 22.1,58.67 22.1,64.01 20.57,65.53 v18.54,65.53
GND  (via drill 0.3)
  Top 0.254: U12.9 18.88,17.78 R33.2 | R34.2 23.81,16.51 23.81,18.41 U12.7 | v18.41,16.83 v18.41,17.78 | v18.41,17.78 v18.41,18.73 | U12.9 v19.68,17.78 | v19.68,17.78 v19.68,18.73 | v19.68,17.78 v19.68,16.83 | v18.41,17.78 U12.9 | C4.2 v36.83,45.72 | CON3.P$15 44.47,48.79 v44.45,48.51 | CON3.P$2 50.97,46.82 v51.05,46.74 | C10.2 47.12,60.33 v46.99,60.45 | C12.2 50.8,58.42 v51.31,58.93 | R7.1 51.69,55.24 v51.82,55.12 | C8.2 51.75,54.04 v52.07,54.36 | C19.2 53.34,53.09 v52.83,53.59 | U18.2 46.48,57.15 46.99,57.66 v46.99,59.18 | C11.2 42.8,59.82 | U17.2 39.37,57.15 | 41.91,60.71 v41.94,60.71 | C18.2 v56.9,54.86 | C20.2 62.17,53.91 v62.48,53.59 | U14.15 58.93,46.49 v59.18,46.74 59.94,46.74 60.43,46.25 U14.18 | U14.6 57.93,48.75 v58.42,48.26 | v59.18,48.26 59.18,48.51 59.44,48.77 U14.3 | C22.1 64.45,46.04 v63.5,46.99 | R14.1 v71.12,46.99 | C5.2 71.18,44.77 v71.12,44.7 | C21.1 65.47,41.98 v65.53,41.91 | Y1.2 67.51,44.39 v66.8,43.69 | D3.3 v63.5,37.08 | R26.2 67.06,39.12 v65.79,37.85 | C34.2 v68.58,30.99 | U5.5 67.18,30.1 v67.56,30.48 | C35.2 57.59,31.56 v57.15,32 | 54.89,30.1 U4.5 57.28,30.1 v57.4,29.97 | v69.09,20.07 68.81,19.78 U8.10 64.49,19.78 U8.49 62.74,17.53 64.52,15.75 64.49,15.72 U8.46 64.49,12.67 v63.75,11.94 | U7.5 69.98,23.24 v70.1,23.37 | C32.2 70.87,19.05 v70.1,19.81 | C13.2 79.38,17.65 v79.5,17.78 | R20.2 v80.26,20.83 | D1.3 78.12,24.78 v78.23,24.89 | U6.5 74.8,30.1 v74.68,30.23 | C33.2 79.82,32.07 v80.01,32.26 | R23.2 v77.98,40.39 | D2.3 v74.42,40.89 | R29.2 56.64,38.86 v55.37,37.59 | D4.3 v53.09,37.08 | C14.2 63.19,9.08 v62.99,8.89 | C15.2 60.39,9.46 v60.96,8.89 | C17.2 69.4,11.62 v69.34,11.68 | S2.1 18,37.3 v18.03,37.34 | S1.1 28.41,37.3 v28.45,37.34
  Top 0.254: S1.2 33.49,37.3 v33.27,37.08 | C28.2 25.65,41.91 v24.64,42.93 | C27.2 27.62,43.25 v27.69,43.18 | C30.2 20,44.77 U3.11 | S2.2 23.08,37.3 v22.86,37.08 | C31.2 44.26,35.24 v44.2,35.31 | v32.26,70.61 34.09,70.61 A1.38 | v39.88,74.42 39.88,73.66 38.86,72.64 | v57.68,51.18 56.29,51.18 R3.1
  Top 0.508: U12.7 19.68,18.41 v19.68,18.73 19.05,18.73 U12.9 | D5.A 19.05,22.86 19.05,26.04 19.05,26.54 C39.2 | 23.5,26.04 23.81,26.04 C40.2 | 40.13,60.07 39.75,60.07 v39.37,60.45 39.37,57.15 39.37,55.37 39.62,55.12 40.39,55.12 41.66,53.85 41.66,53.34 | 40.13,60.07 C9.2 | C6.2 41.66,53.34 | C7.2 41.66,53.34 | 42.8,59.82 40.38,59.82 40.13,60.07 | 41.91,60.71 41.91,59.94
  Top 0.61: v30.73,59.44 30.73,50.04 v31.75,49.02 | C45.- 37.59,9.98 | 37.59,9.98 C46.- | v37.08,9.98 37.59,9.98
  Top 0.813: v18.36,52.7 A1.15 14.86,52.71 14.73,52.58 12.89,52.58 C3.2 | C36.2 C29.2 43.51,74.85 43.08,74.42 v41.91,74.42 | CON1.3 CON1.1 37.91,26.67 v36.58,26.67 v34.29,24.38 v32.51,24.38 | v20.83,51.56 v20.07,51.56 v20.07,49.53 v21.59,49.53 v21.59,51.56 v20.83,51.56 | v20.83,49.53 v20.83,51.56 | v20.32,40.13 v19.56,40.13 v19.56,38.1 v21.08,38.1 v21.08,40.13 v20.32,40.13 | v20.32,38.1 v20.32,40.13
  Top 1.016: A1.38 A1.1 16.28,70.8 C2.2 | v11.94,62.23 11.94,63.5 12.58,63.5 C1.2 | C1.2 v12.7,62.23 | v13.46,62.23 13.46,63.5 12.82,63.5 C1.2 | v54.61,43.43 v54.61,42.67 v56.64,42.67 v56.64,41.91 | v56.64,41.91 v54.61,41.91 v54.61,43.43 | v54.61,43.43 v56.64,43.43 v56.64,41.91 | v66.29,58.93 v65.53,58.93 v65.53,66.55 v66.29,66.55 | v67.06,58.93 v67.82,58.93 | v67.82,58.93 v68.58,58.93 v68.58,66.55 v67.82,66.55 | v67.06,66.55 v66.29,66.55 | v66.29,66.55 v66.29,58.93 | v66.29,58.93 v67.06,58.93 | v67.06,58.93 v67.06,66.55 | v67.06,66.55 v67.82,66.55 | v67.82,66.55 v67.82,58.93 | v45.72,38.61 v45.72,37.85 v43.18,37.85 v43.18,38.61 | v45.72,38.61 v45.72,39.37 v43.18,39.37 v43.18,38.61 | v43.18,38.61 v45.72,38.61 | v32.51,23.62 v32.51,22.86 v27.94,22.86 v27.94,23.62 | v32.51,23.62 v32.51,24.38 v27.94,24.38 v27.94,23.62 | v27.94,23.62 v32.51,23.62 | v30.48,63.25 v32.51,63.25 v32.51,62.48 v30.48,62.48 v30.48,63.25
  Top 1.27: 19.05,26.04 18.73,26.04 C38.2 | 14.29,27.31 13.65,26.67
  Top 1.524: C38.2 14.29,27.31 | 13.65,26.67 C42.2 C43.2 11.3,24.77 9.84,24.77 8.89,23.81 8.89,19.05 9.53,18.41 C44.2
  Top 2.54: U12.9 19.05,26.04 23.5,26.04 | 23.37,70.1 v23.37,63.75 | v23.37,61.98 24.02,62.63 A1.39 | v38.35,73.15 38.1,72.9 38.1,71.88 38.86,72.64 39.62,73.41 39.62,73.66 39.9,73.94 41.38,73.94
  other vias: 19.05,70.61 22.86,70.61 27.43,70.61 24.89,63.75 24.89,61.98 37.59,73.15 37.59,72.39 37.59,71.63 38.35,71.63 38.35,72.39 40.89,74.42 41.91,73.66 41.4,73.15 40.89,73.66 14.22,52.58 15.24,52.7 59.18,47.5 58.42,46.74 58.42,47.5 15.11,27.62 21.97,25.08 23.5,25.08 20.45,25.08 14.1,27.62 9.02,23.3 9.02,21.53 9.02,20 34.29,9.98 35.05,9.98 36.07,9.98 19.05,45.72
  pour Bottom (isolate 0.254): 0.76,89.15 89.15,89.15 89.15,0.76 0.76,0.76
MAX_IO0  (via drill 0.3)
  Top 0.254: U8.11 67.33,20.28 v67.39,20.3 | v42.42,9.65 42.42,10.77 S8.1B
  Bottom 0.254: v67.39,20.3 66.27,20.3 64.52,18.54 64.52,14.48 59.69,9.65 44.7,9.65 43.94,8.89 43.18,8.89 v42.42,9.65
MAX_IO1  (via drill 0.3)
  Top 0.254: U8.12 v67.02,20.78 v67.03,20.78 | v43.69,9.65 43.69,10.77 S8.2B
  Bottom 0.254: v67.03,20.78 65.99,20.78 64.01,18.8 64.01,14.73 59.44,10.16 44.2,10.16 v43.69,9.65
MAX_IO2  (via drill 0.3)
  Top 0.254: U8.13 65.49,22.93 v65.48,22.94 | v45.21,11.94 45.21,11.02 S8.3B
  Bottom 0.254: v65.48,22.94 65.48,21.03 63.5,19.05 63.5,14.99 59.18,10.67 46.48,10.67 v45.21,11.94
MAX_IO3  (via drill 0.3)
  Top 0.254: U8.14 64.99,22.39 v65,22.4 | v46.48,11.94 46.48,11.02 S8.4B
  Bottom 0.254: v65,22.4 65,21.31 62.99,19.3 62.99,15.24 59.18,11.43 46.99,11.43 v46.48,11.94
MAX_IO4  (via drill 0.3)
  Top 0.254: U8.19 v62.49,23.09 v62.48,23.09 | v47.75,11.94 47.75,11.02 S8.5B
  Bottom 0.254: v62.48,23.09 62.48,15.49 58.93,11.94 v47.75,11.94
MAX_IO5  (via drill 0.3)
  Top 0.254: 62,22.45 61.99,22.44 U8.20 61.99,22.41 v62,22.43 | v49.02,12.45 49.02,11.02 S8.6B
  Bottom 0.254: v62,22.43 62,15.77 58.67,12.45 v49.02,12.45
MAX_IO6  (via drill 0.3)
  Top 0.254: U8.21 v61.49,23.08 v61.49,23.09 | v50.29,12.95 50.29,11.02 S8.7B
  Bottom 0.254: v61.49,23.09 61.49,16.03 58.42,12.95 v50.29,12.95
MAX_IO7  (via drill 0.3)
  Top 0.254: U8.22 60.99,22.55 60.98,22.55 | U8.22 v60.99,22.58 v60.98,22.58 60.99,22.56 U8.22 | v51.31,13.46 51.31,11.02 S8.8B
  Bottom 0.254: v60.98,22.58 61.01,16.31 58.17,13.46 v51.31,13.46
MAX_IO8  (via drill 0.3)
  Top 0.254: U8.27 v58.45,19.78 v58.45,19.79 | v43.18,23.37 CON1.6
  Bottom 0.254: v43.18,23.37 41.91,24.64 41.91,27.94 42.67,28.7 56.13,28.7 58.45,26.39 v58.45,19.78
MAX_IO9  (via drill 0.3)
  Top 0.254: U8.28 v57.84,19.28 | v44.45,23.11 44.45,22.67 CON1.8
  Bottom 0.254: v44.45,23.11 42.67,24.89 42.67,27.69 42.93,27.94 55.88,27.94 57.84,25.98 v57.84,19.28
MAX_IO10  (via drill 0.3)
  Top 0.254: U8.29 58.43,18.78 v58.42,18.8 | v46.99,23.11 46.99,22.67 CON1.10
  Bottom 0.254: v46.99,23.11 46.74,23.37 45.21,23.37 43.43,25.15 43.43,26.92 43.69,27.18 55.63,27.18 57.15,25.65 57.15,19.05 57.4,18.8 v58.42,18.8
MAX_IO11  (via drill 0.3)
  Top 0.254: U8.30 v57.92,18.28 v57.91,18.29 | v48.01,23.11 50.04,23.11 50.8,22.35 CON1.12
  Bottom 0.254: v48.01,23.11 47.24,23.88 45.47,23.88 44.2,25.15 44.2,26.42 44.45,26.67 55.12,26.67 56.39,25.4 56.39,19.05 57.02,18.41 57.15,18.28 v57.92,18.28
MAX_IO12  (via drill 0.3)
  Top 0.254: v52.07,25.91 51.75,25.91 CON1.11 | U8.35 58.2,15.78 v58.19,15.77
  Bottom 0.254: v52.07,25.91 55.12,25.91 55.88,25.15 55.88,18.8 58.19,16.48 v58.19,15.77
MAX_IO13  (via drill 0.3)
  Top 0.254: v49.53,25.91 49.21,25.91 CON1.9 | U8.36 57.45,15.28 v57.4,15.24
  Bottom 0.254: v49.53,25.91 50.29,25.15 54.61,25.15 55.37,24.38 55.37,18.54 56.13,17.78 56.13,16 56.9,15.24 v57.4,15.24
MAX_IO14  (via drill 0.3)
  Top 0.254: v46.74,25.91 46.67,25.91 CON1.7 | U8.37 57.56,14.58 v57.51,14.63
  Bottom 0.254: v46.74,25.91 48.26,24.38 54.1,24.38 54.86,23.62 54.86,18.29 55.63,17.53 55.63,15.75 56.74,14.63 v57.51,14.63
MAX_IO15  (via drill 0.3)
  Top 0.254: U8.38 60.49,14.01 60.2,13.72 58.4,13.72 v58.01,14.1 | v45.97,24.89 44.2,24.89 42.93,26.16 42.93,26.61 CON1.5
  Bottom 0.254: v58.01,14.1 56.52,14.1 54.1,16.51 54.1,22.1 52.58,23.62 48.26,23.62 46.99,24.89 v45.97,24.89
N$1  (via drill 0.3)
  Top 0.254: 47.97,51.02 v47.88,51.05 47.97,50.96 CON3.P$8 | v51.05,51.31 51.18,51.18 53.44,51.18 R3.2
  Bottom 0.254: v51.05,51.31 48.13,51.31 v47.88,51.05
N$2
  Top 0.254: 36.9,48.77 C4.1 | R4.2 36.83,49.28 | 36.83,49.28 C4.1 | 36.64,48.51 C4.1 | 36.83,49.28 37.34,48.77 38.61,48.77 39.88,47.5 48.01,47.5 48.97,48.46 CON3.P$6
N$3
  Top 0.254: U8.18 62.99,25.65 64.52,27.18 69.39,27.18 U7.4
N$4
  Top 0.254: R5.2 55.56,60.13 54.61,59.18 53.59,59.18 53.34,58.93 R6.1
N$5
  Top 0.254: U8.17 63.49,23.61 65.02,25.15 73.41,25.15 73.91,25.65 73.91,26.47 U7.1
N$6
  Top 0.254: U8.26 58.2,20.28 57.66,20.83 57.66,24.64 61.21,28.19 62.74,28.19 64.01,29.46 68.07,29.46 68.58,29.97 71.07,29.97 U6.4
N$7
  Top 0.254: U8.25 58.46,20.78 58.17,21.08 58.17,24.38 61.47,27.69 62.99,27.69 64.26,28.96 69.6,28.96 70.1,29.46 72.64,29.46 72.64,33.53 72.39,33.78 71.32,33.78 U6.1
N$8
  Top 0.254: U5.4 60.91,29.97 59.94,29.97 58.29,28.32 57.91,27.94 56.13,26.16 56.13,16.76 56.61,16.28 U8.34
N$9
  Top 0.254: U5.1 61.16,34.04 62.23,34.04 62.48,33.78 62.48,29.72 61.98,29.21 60.71,29.21 56.64,25.15 56.64,17.27 57.13,16.78 U8.33
N$10
  Top 0.254: U8.42 62.49,12.7 61.98,12.19 57.66,12.19 54.61,15.24 54.61,27.94 52.58,29.97 51,29.97 U4.4
N$11
  Top 0.254: U8.41 61.98,14.57 61.98,12.95 61.72,12.7 57.91,12.7 55.12,15.49 55.12,28.19 52.32,30.99 52.32,33.53 52.07,33.78 51,33.78 U4.1
N$12
  Top 0.254: U8.15 64.49,23.09 66.04,24.64 73.66,24.64 74.42,25.4 74.42,27.94 74.17,28.19 72.14,28.19 71.88,27.94 71.88,26.67 | 71.88,26.67 71.32,26.67 U7.3 | U7.2 71.96,26.59 71.88,26.67
N$13
  Top 0.254: U8.23 60.49,25.94 61.72,27.18 63.25,27.18 64.52,28.45 70.1,28.45 70.61,28.96 72.9,28.96 73.15,29.21 73.15,34.04 72.64,34.54 70.1,34.54 69.85,34.29 69.85,32.77 70.1,32.51 71.07,32.51 U6.2 U6.3
N$14  (via drill 0.3)
  Top 0.254: C13.1 76.39,17.21 v75.69,16.51 | v72.39,16.51 R12.2 70.97,17.17 69.95,17.17 69.85,17.27 69.85,18.03 69.09,18.8 66.2,18.8 U8.8
  Bottom 0.254: v75.69,16.51 v72.39,16.51
N$15
  Top 0.254: U8.31 57.4,17.78 57.15,18.03 57.15,24.89 60.96,28.7 62.23,28.7 62.99,29.46 62.99,34.04 62.48,34.54 59.94,34.54 59.69,34.29 59.69,32.77 59.94,32.51 60.91,32.51 | 60.91,32.51 U5.2 | 60.91,32.51 60.91,31.5 U5.3
N$16
  Top 0.254: U4.2 U4.3 50.88,32.69 50.8,32.77 50.04,32.77 49.53,33.27 49.53,34.54 52.07,34.54 52.83,33.78 52.83,31.24 55.63,28.45 55.63,15.75 58.17,13.21 60.71,13.21 60.96,13.46 60.96,14.55 U8.39
N$17
  Top 0.254: U8.48 65.49,10.69 C14.1
N$18
  Top 0.254: 62.23,47.75 U14.22
  Top 0.508: C22.2 62.8,47.94 62.48,47.75 62.23,47.75
N$19  (via drill 0.3)
  Top 0.254: U14.17 59.93,44.46 v59.94,44.45
  Top 0.61: SPR1.+ 59.2,59.18 61.21,59.18 v61.98,58.42
  Bottom 0.61: v59.94,44.45 59.94,57.15 61.21,58.42 v61.98,58.42
N$20  (via drill 0.3)
  Top 0.254: U14.19 61.23,44.47 v61.21,44.45
  Top 0.61: v61.98,57.4 73.92,57.4 SPR1.-
  Bottom 0.61: v61.21,44.45 61.21,56.64 v61.98,57.4
N$21  (via drill 0.3)
  Top 0.254: C23.2 72.07,48.19 | R14.2 72.07,47.46 72.07,48.19 | 72.07,48.19 72.14,48.26 68.07,48.26 67.82,48.01 67.82,46.99 v68.07,46.74
  Bottom 0.254: U$6.- 69.69,46.13 69.09,46.74 v68.07,46.74
N$22  (via drill 0.3)
  Top 0.254: R15.2 75.03,45.82 | C24.2 72.64,53.28 72.64,51.56 72.9,51.31 73.15,51.31 74.93,49.53 R16.1 75.25,49.06 C26.2 75.03,46.77 75.03,45.82 | 75.03,45.82 74.93,45.72 U$6.+
  other vias: 68.58,45.72
N$23  (via drill 0.3)
  Top 0.254: U14.23 61.96,48.25 v62.99,49.28 | v68.33,49.28 69.92,49.28 C23.1
  Bottom 0.254: v62.99,49.28 v68.33,49.28
N$24  (via drill 0.3)
  Top 0.254: U14.24 61.23,48.79 v62.48,50.04 | v68.33,50.04 70.36,52.07 70.36,52.89 C24.1
  Bottom 0.254: v62.48,50.04 v68.33,50.04
N$25
  Top 0.254: C25.1 75.4,51.75 R16.2 74.93,54.61 74.68,54.86 69.85,54.86 68.33,53.34 68.33,51.05 67.94,50.67 61.09,50.67 60.45,50.04 60.45,49.57 U14.1
N$26
  Top 0.254: R15.1 77.88,46.26 C26.1 77.15,49.53 C25.2
N$27  (via drill 0.3)
  Top 0.254: C28.1 27.69,41.91 28.19,41.4 28.19,40.39 28.45,40.13 24.89,40.13 23.88,41.15 23.88,44.2 v22.61,45.47
  Top 0.508: R17.1 28.3,41.23 C28.1
  Bottom 0.254: v22.61,45.47 23.62,45.47 23.88,45.72 U1.5
N$28
  Bottom 0.254: U3.4 U3.5
N$29  (via drill 0.3)
  Top 0.254: R30.1 20.73,43.08 21.34,43.69 v21.34,46.23
  Bottom 0.254: v21.34,46.23 20.4,46.23 U3.2
N$30
  Top 0.254: 62.48,46.74 61.24,46.74 U14.20
  Top 0.508: 62.48,46.74 63.57,45.65 C21.2 63.57,43.5 64.52,44.45 66.55,44.45 66.8,44.7 R31.2
N$32
  Top 0.254: U12.4 16.04,15.88 R33.1
N$33
  Top 0.254: U12.5 21.52,13.65 C37.2 24.13,13.65 R36.2 R35.2 26.82,14.12 R34.1
N$34  (via drill 0.3)
  Top 0.254: C41.2 v15.88,23.5 | U12.8 v23.18,19.68
  Top 1.27: 30.4,19.68 L2.P$1 | 23.81,22.84 D5.C
  Top 1.778: 23.81,19.68 30.4,19.68 | v23.18,19.68 23.81,19.68 | 23.81,19.68 23.81,22.84
  Bottom 0.254: v15.88,23.5 19.37,23.5 v23.18,19.68
N$35
  Top 0.254: C41.1 15.88,20.39 U12.1
RS485_A0  (via drill 0.3)
  Top 0.254: U7.6 71.25,23.75 71.63,24.13 73.91,24.13 75.44,25.65 75.79,25.65 R19.1 | R19.1 79.39,25.81 D1.2 80.19,25.15 v81.28,25.15 | R18.2 76.05,25.91 R19.1 | CON2.1 39.37,67.5 v39.37,65.28
  Bottom 0.254: v39.37,65.28 50.55,65.28 52.32,63.5 79.76,63.5 84.58,58.67 84.58,26.16 83.57,25.15 v81.28,25.15
RS485_A1  (via drill 0.3)
  Top 0.254: R22.1 73.66,35.41 73.66,31.75 74.04,31.37 U6.6 76.25,31.24 77.22,31.24 77.98,30.48 v78.49,30.48 | R22.1 73,39.52 D2.2 | R22.1 70.97,36.07 R21.2 | CON2.3 40.64,66.55 41.91,65.28 v41.91,64.26
  Bottom 0.254: v41.91,64.26 50.04,64.26 51.82,62.48 78.99,62.48 83.31,58.17 83.31,31.24 83.06,30.99 80.77,30.99 80.26,30.48 v78.49,30.48
RS485_A2  (via drill 0.3)
  Top 0.254: U5.6 64.39,31.37 v64.01,31.75 63.5,32.26 63.5,35.81 63.25,36.07 R25.1 | R25.1 60.3,36.07 R24.2 | R25.1 62.08,39.52 D3.2 | CON2.5 43.18,66.55 44.45,65.28 v44.45,62.99
  Bottom 0.254: v44.45,62.99 44.7,63.25 49.53,63.25 51.31,61.47 77.72,61.47 81.79,57.4 81.79,38.86 80.52,37.59 69.85,37.59 v64.01,31.75
RS485_A3  (via drill 0.3)
  Top 0.254: U4.6 54.48,31.37 53.34,32.51 53.34,34.39 R28.1 | R28.1 49.63,36.07 R27.2 | R28.1 v51.66,38.86 51.66,39.12 51.66,39.52 D4.2 52.14,39.94 51.82,39.62 | CON2.7 45.72,66.55 46.99,65.28 v46.99,62.23
  Bottom 0.254: v46.99,62.23 49.02,62.23 50.8,60.45 76.71,60.45 80.77,56.39 80.77,39.62 80.01,38.86 v51.66,38.86
RS485_B0  (via drill 0.3)
  Top 0.254: U7.7 72.52,23.24 72.9,23.62 75.29,23.62 R19.2 | R19.2 79.9,22.96 D1.1 80.31,23.37 v81.53,23.37 | R20.1 76.05,22.86 R19.2 | CON2.2 38.16,63.31 v39.37,64.52
  Bottom 0.254: v39.37,64.52 39.62,64.52 39.88,64.77 50.29,64.77 52.07,62.99 79.25,62.99 83.82,58.42 83.82,26.92 83.06,26.16 80.26,26.16 80.26,24.64 v81.53,23.37
RS485_B1  (via drill 0.3)
  Top 0.254: U6.7 75.06,32.64 74.42,33.27 74.42,34.65 R22.2 | R22.2 75.84,39.52 D2.1 | R22.2 77.88,36.07 R23.1 78.08,36.07 v80.26,36.07 | CON2.4 41.85,63.31 v41.91,63.25
  Bottom 0.254: v41.91,63.25 42.16,63.25 42.67,63.75 49.78,63.75 51.56,61.98 78.49,61.98 82.55,57.91 82.55,38.35 v80.26,36.07
RS485_B2  (via drill 0.3)
  Top 0.254: U5.7 64.9,32.64 64.52,33.02 64.52,35.66 R25.2 | R25.2 64.92,39.52 D3.1 | R25.2 66.7,36.07 R26.1 v67.06,37.85 | CON2.6 43.18,63.25 v44.2,62.23
  Bottom 0.254: v44.2,62.23 44.7,62.23 45.21,62.74 49.28,62.74 51.05,60.96 76.96,60.96 81.28,56.64 81.28,39.12 80.26,38.1 67.31,38.1 v67.06,37.85
RS485_B3  (via drill 0.3)
  Top 0.254: U4.7 54.99,32.64 54.1,33.53 54.1,35.66 R28.2 | R28.2 56.54,36.07 R29.1 | R28.2 54.51,39.52 D4.1 54.4,39.62 v55.12,39.62 | CON2.8 45.72,62.48 46.48,61.72 46.74,61.72 v46.99,61.47
  Bottom 0.254: v46.99,61.47 49.02,61.47 50.55,59.94 76.45,59.94 80.26,56.13 80.26,39.88 79.76,39.37 55.37,39.37 v55.12,39.62

## Text on the board
tNames: https://github.com/pknoe3lh/DIYsmarthome